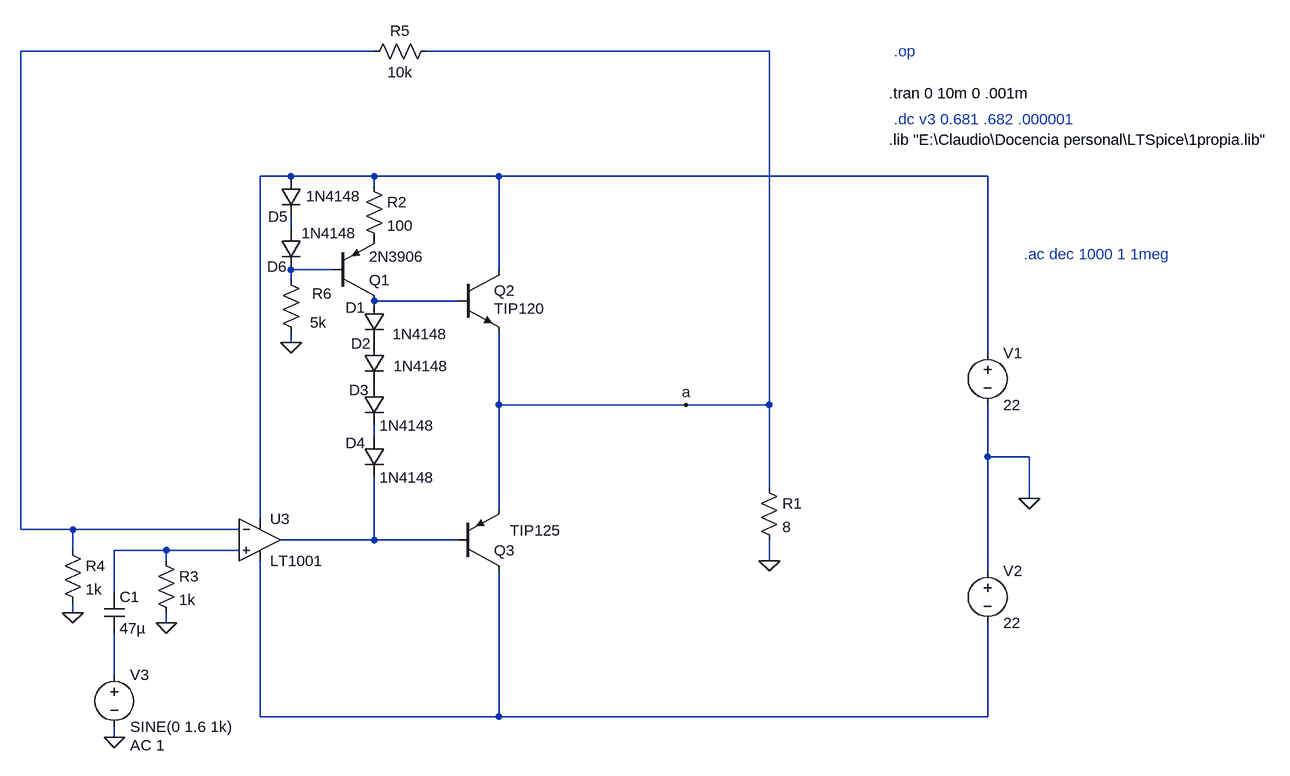
[diagram p0: schematic clase b darlington 2xx.asc]
clase b darlington 2xx.asc, the LTspice schematic file:
Version 4
SHEET 1 1988 812
WIRE 544 -272 0 -272
WIRE 1152 -272 624 -272
WIRE 416 -80 368 -80
WIRE 544 -80 416 -80
WIRE 736 -80 544 -80
WIRE 1488 -80 736 -80
WIRE 544 -64 544 -80
WIRE 416 0 416 -16
WIRE 480 64 416 64
WIRE 736 64 736 -80
WIRE 416 80 416 64
WIRE 672 112 544 112
WIRE 416 176 416 160
WIRE 1488 192 1488 -80
WIRE 736 272 736 160
WIRE 1024 272 736 272
WIRE 1152 272 1152 -272
WIRE 1152 272 1024 272
WIRE 544 320 544 304
WIRE 1488 352 1488 272
WIRE 1552 352 1488 352
WIRE 1152 400 1152 272
WIRE 1552 416 1552 352
WIRE 736 432 736 272
WIRE 368 448 368 -80
WIRE 0 464 0 -272
WIRE 80 464 0 464
WIRE 336 464 80 464
WIRE 544 480 544 384
WIRE 544 480 400 480
WIRE 672 480 544 480
WIRE 80 496 80 464
WIRE 224 496 144 496
WIRE 336 496 224 496
WIRE 224 512 224 496
WIRE 1152 512 1152 480
WIRE 1488 528 1488 352
WIRE 144 560 144 496
WIRE 80 592 80 576
WIRE 224 608 224 592
WIRE 144 688 144 624
WIRE 368 752 368 512
WIRE 736 752 736 528
WIRE 736 752 368 752
WIRE 1488 752 1488 608
WIRE 1488 752 736 752
WIRE 144 784 144 768
FLAG 1152 512 0
FLAG 1552 416 0
FLAG 224 608 0
FLAG 80 592 0
FLAG 144 784 0
FLAG 416 176 0
FLAG 1024 272 a
SYMBOL res 1136 384 R0
SYMATTR InstName R1
SYMATTR Value 8
SYMBOL voltage 1488 176 R0
WINDOW 123 0 0 Left 0
WINDOW 39 0 0 Left 0
SYMATTR InstName V1
SYMATTR Value 22
SYMBOL voltage 1488 512 R0
WINDOW 123 0 0 Left 0
WINDOW 39 0 0 Left 0
SYMATTR InstName V2
SYMATTR Value 22
SYMBOL OpAmps\\LT1001 368 416 R0
SYMATTR InstName U3
SYMBOL res 208 496 R0
SYMATTR InstName R3
SYMATTR Value 1k
SYMBOL res 64 480 R0
SYMATTR InstName R4
SYMATTR Value 1k
SYMBOL res 640 -288 R90
WINDOW 0 0 56 VBottom 2
WINDOW 3 32 56 VTop 2
SYMATTR InstName R5
SYMATTR Value 10k
SYMBOL diode 528 112 R0
WINDOW 0 -28 10 Left 2
WINDOW 3 44 51 Left 2
SYMATTR InstName D1
SYMATTR Value 1N4148
SYMBOL diode 528 176 R0
WINDOW 0 -20 2 Left 2
WINDOW 3 46 36 Left 2
SYMATTR InstName D2
SYMATTR Value 1N4148
SYMBOL diode 528 240 R0
WINDOW 0 -23 9 Left 2
SYMATTR InstName D3
SYMATTR Value 1N4148
SYMBOL diode 528 320 R0
WINDOW 0 -28 11 Left 2
SYMATTR InstName D4
SYMATTR Value 1N4148
SYMBOL voltage 144 672 R0
WINDOW 123 24 124 Left 2
WINDOW 39 0 0 Left 0
SYMATTR Value2 AC 1
SYMATTR InstName V3
SYMATTR Value SINE(0 1.6 1k)
SYMBOL cap 128 560 R0
SYMATTR InstName C1
SYMATTR Value 47µ
SYMBOL pnp 480 112 M180
SYMATTR InstName Q1
SYMATTR Value 2N3906
SYMBOL res 528 -80 R0
SYMATTR InstName R2
SYMATTR Value 100
SYMBOL res 400 64 R0
WINDOW 0 48 37 Left 2
WINDOW 3 45 81 Left 2
SYMATTR InstName R6
SYMATTR Value 5k
SYMBOL diode 400 -80 R0
WINDOW 0 -19 62 Left 2
WINDOW 3 39 31 Left 2
SYMATTR InstName D5
SYMATTR Value 1N4148
SYMBOL diode 400 0 R0
WINDOW 0 -21 59 Left 2
WINDOW 3 32 8 Left 2
SYMATTR InstName D6
SYMATTR Value 1N4148
SYMBOL npn 672 64 R0
WINDOW 123 56 60 Left 2
SYMATTR Value2 TIP120
SYMATTR InstName Q2
SYMATTR Value ""
SYMATTR Prefix x
SYMBOL pnp 672 528 M180
WINDOW 123 81 63 Left 2
SYMATTR Value2 TIP125
SYMATTR InstName Q3
SYMATTR Value ""
SYMATTR Prefix x
TEXT 1336 -136 Left 2 !.lib "E:\\Claudio\\Docencia personal\\LTSpice\\1propia.lib"
TEXT 1344 -272 Left 2 ;.op
TEXT 1344 -168 Left 2 ;.dc v3 0.681 .682 .000001
TEXT 1336 -208 Left 2 !.tran 0 10m 0 .001m
TEXT 1544 40 Left 2 ;.ac dec 1000 1 1meg

The netlist it stands for:
* clase b darlington 2xx.asc
R1 a 0 8
V1 N002 0 22
V2 0 N010 22
XU3 N008 N001 N002 N010 N007 LT1001  ; pins In+ In- V+ V- OUT
R3 N008 0 1k
R4 N001 0 1k
R5 a N001 10k
D1 N005 P001 1N4148
D2 P001 P002 1N4148
D3 P002 N006 1N4148
D4 N006 N007 1N4148
V3 N009 0 SINE(0 1.6 1k) AC 1
C1 N008 N009 47µ
Q1 N005 N004 P003 0 2N3906
R2 N002 P003 100
R6 N004 0 5k
D5 N002 N003 1N4148
D6 N003 N004 1N4148
XQ2 N002 N005 a TIP120  ; pins C B E
XQ3 N010 N007 a TIP125  ; pins C B E
.model D D
.lib standard.dio
.model NPN NPN
.model PNP PNP
.lib standard.bjt
.lib "E:\Claudio\Docencia personal\LTSpice\1propia.lib"
* .op
* .dc v3 0.681 .682 .000001
.tran 0 10m 0 .001m
* .ac dec 1000 1 1meg
.lib LTC.lib
.backanno
.end